# EasyEDA schematic 炫彩灯带_2021-06-24.json
TITLE: 幻彩灯带SOC免开发版; REV: 0.0; Date: 2021-05-28; Sheet: 1/2; Drawn By: QQ1445886007; Company: Your Company
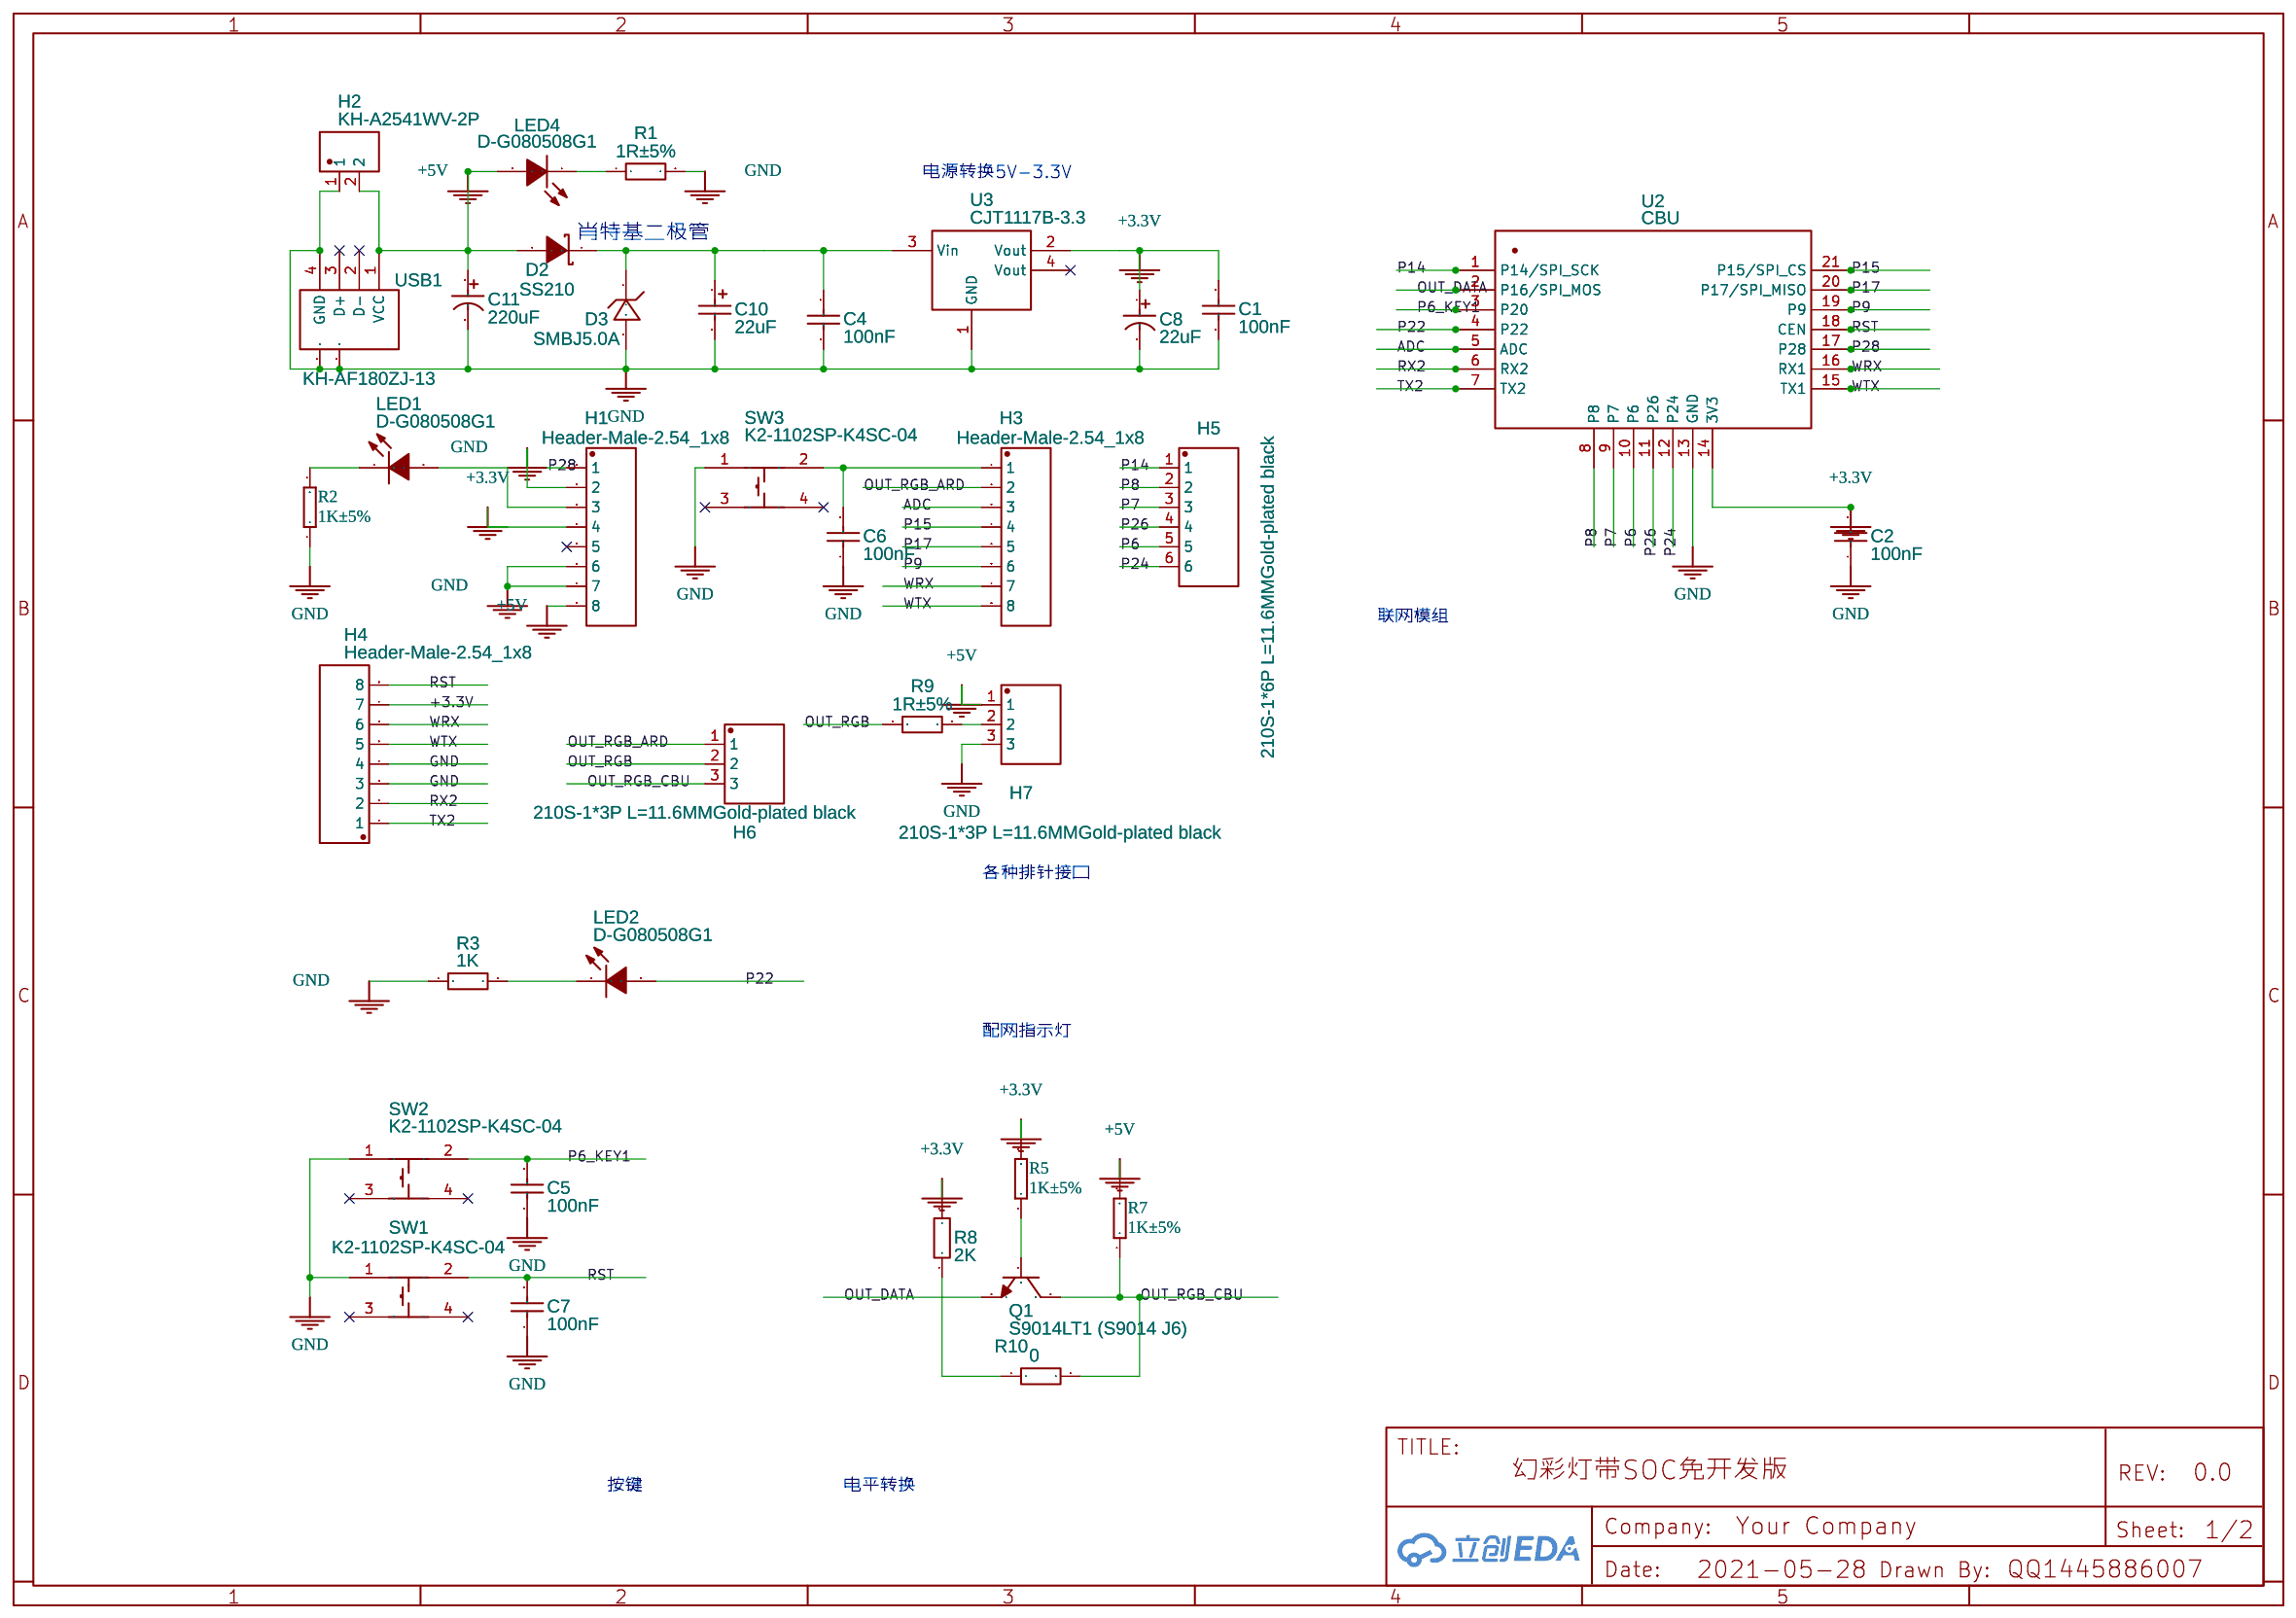
[diagram p0: schematic sheet]

## Parts
C1  100nF  [C0603]
C2  100nF  [C0603]
C4  100nF  [C0603]
C5  100nF  [C0603]
C6  100nF  [C0603]
C7  100nF  [C0603]
C8  22uF  [CAP-TH_BD4.0-P1.50-D0.8-FD]
C10  22uF  [CAP-SMD_L3.5-W2.8]
C11  220uF  [CAP-TH_BD6.3-P2.50-D1.0-FD]
D2  SS210  [SMA_L4.4-W2.6-LS5.0-RD]
D3  SMBJ5.0A  [SMB_L4.6-W3.6-LS5.3-RD]
H1  Header-Male-2.54_1x8  [HDR-TH_8P-P2.54-V-M]
H2  KH-A2541WV-2P  [HDR-TH_2P-P2.54-V-M]
H3  Header-Male-2.54_1x8  [HDR-TH_8P-P2.54-V-M]
H4  Header-Male-2.54_1x8  [HDR-TH_8P-P2.54-V-M]
H5  210S-1*6P L=11.6MMGold-plated black  [HDR-TH_6P-P2.54-V_Z-211-0611-0021-001]
H6  210S-1*3P L=11.6MMGold-plated black  [HDR-TH_3P-P2.54-V]
H7  210S-1*3P L=11.6MMGold-plated black  [HDR-TH_3P-P2.54-V]
LED1  D-G080508G1  [LED0805-RD]
LED2  D-G080508G1  [LED0805-RD]
LED4  D-G080508G1  [LED0805-RD]
Q1  S9014LT1 (S9014 J6)  [SOT-23-3_L2.9-W1.3-P1.90-LS2.4-BR]
R1  1R±5%  [R0603]
R2  1K±5%  [R0603]
R3  1K  [R0603]
R5  1K±5%  [R0603]
R7  1K±5%  [R0603]
R8  2K  [R0603]
R9  1R±5%  [R0603]
R10  0  [R0603]
SW1  K2-1102SP-K4SC-04  [KEY-SMD_4P-L6.0-W6.0-P4.50-LS10.0]
SW2  K2-1102SP-K4SC-04  [KEY-SMD_4P-L6.0-W6.0-P4.50-LS10.0]
SW3  K2-1102SP-K4SC-04  [KEY-SMD_4P-L6.0-W6.0-P4.50-LS10.0]
U2  CBU  [CBU]
U3  CJT1117B-3.3  [SOT-223-4_L6.5-W3.5-P2.30-LS7.0-BR]
USB1  KH-AF180ZJ-13  [USB-A-TH_KH-AF180ZJ-13]

## Library data of the parts
C1 C2 C4-C7 = CL10F104ZA8NNNC: Supplier: LCSC; Manufacturer: SAMSUNG; Supplier Part: C95838; JLCPCB Part Class: Extended Part
C8 = KS1C220MB070A00CV0: Supplier: LCSC; Supplier Part: C216316; Manufacturer: Changzhou Huawei Elec; Contributor: LCSC; JLCPCB Part Class: Extended Part
C10 = CA45-B010K226T: Supplier: LCSC; Manufacturer: Xiangyee; Supplier Part: C122758; JLCPCB Part Class: Extended Part
C11 = 220uF 10V 6.3*7: Supplier: LCSC; Manufacturer: ValuePro; Supplier Part: C43331; JLCPCB Part Class: Extended Part
D2 = SS210_C84030: Supplier: LCSC; Manufacturer: STARSEA; Supplier Part: C84030; JLCPCB Part Class: Extended Part
D3 = SMBJ5.0A_C169448: Supplier: LCSC; Supplier Part: C169448; Manufacturer: Shandong Jingdao Microelectronics; Contributor: LCSC; JLCPCB Part Class: Extended Part
H1 H3 H4 = Header-Male-2.54_1x8: Supplier: LCSC; Manufacturer: Ckmtw; Manufacturer Part: 210S-1*8P L=11.6MMGold-plated black; Contributor: LCSC; Supplier Part: C124381; JLCPCB Part Class: Extended Part; Package Display: No
H2 = KH-A2541WV-2P: Supplier: LCSC; Supplier Part: C2833329; Manufacturer: kinghelm(金航标); Contributor: LCSC
H5 = 210S-1*6P L=11.6MMGold-plated black: Supplier: LCSC; Manufacturer: Ckmtw; Contributor: LCSC; Supplier Part: C124380; JLCPCB Part Class: Extended Part; Package Display: No
H6 H7 = 210S-1*3P L=11.6MMGold-plated black: Supplier: LCSC; Manufacturer: Ckmtw; Contributor: LCSC; Supplier Part: C124376; JLCPCB Part Class: Extended Part; Package Display: No
LED1 LED2 LED4 = D-G080508G1: Supplier: LCSC; Manufacturer: ARKLED; Contributor: LCSC; Supplier Part: C107402; JLCPCB Part Class: Extended Part
Q1 = S9014LT1 (S9014 J6): Supplier: LCSC; Manufacturer: CJ; Supplier Part: C2148; JLCPCB Part Class: Extended Part
R1 R9 = 0603WAJ010JT5E: Supplier: LCSC; Manufacturer: UniOhm; Supplier Part: C25212; JLCPCB Part Class: Extended Part
R3 = RK73B1JTTD102J: Supplier: LCSC; Manufacturer: KOA; Supplier Part: C131707; JLCPCB Part Class: Extended Part
R8 = RM06FTN2001: Supplier: LCSC; Manufacturer: TA-I; Contributor: LCSC; Supplier Part: C114806
R10 = RM06JTN0: Supplier: LCSC; Supplier Part: C188117; Manufacturer: TA-I Tech; Contributor: LCSC
SW1-SW3 = K2-1102SP-K4SC-04: Supplier: LCSC; Manufacturer: HRO; Contributor: LCSC; Supplier Part: C129461; JLCPCB Part Class: Extended Part
U2 = CBU: Supplier: 涂鸦智能; link: https://developer.tuya.com/cn/docs/iot/device-development/module/wifibt-dual-mode-module/cb-series-module/cbu-module-datasheet?id=Ka07pykl5dk4u#title-5-%E5%B0%BA%E5%AF%B8%E5%B0%81%E8%A3%85; Contributor: anhezhou
U3 = CJT1117B-3.3: Supplier: LCSC; Manufacturer: CJ; Supplier Part: C78777; JLCPCB Part Class: Extended Part
USB1 = KH-AF180ZJ-13: Supplier: LCSC; Supplier Part: C2833344; Manufacturer: kinghelm(金航标); Contributor: LCSC; Package Display: No

## Nets
+3.3V: C1.2 C2.2 C8.1 H1.4 H4.7 R5.2 R8.1 U2.14(3V3) U3.2(Vout)
+5V: C11.1 D2.2(A) H1.8 H2.2 H7.1 LED4.2(A) R7.2 USB1.1(VCC)
GND: C1.1 C2.1 C4.1 C5.1 C6.1 C7.1 C8.2 C10.2 C11.2 D3.2 H1.2 H1.6 H1.7 H2.1 H4.3 H4.4 H7.3 R1.2 R2.1 R3.1 SW1.1 SW2.1 SW3.1 U2.13(GND) U3.1(GND) USB1.4(GND) USB1.5 USB1.6
ADC: H3.3 U2.5(ADC)
OUT_DATA: Q1.2(E) R8.2 R10.1 U2.2(P16/SPI_MOS)
OUT_RGB: H6.2 R9.1
OUT_RGB_ARD: H3.2 H6.1
OUT_RGB_CBU: H6.3 Q1.3(C) R7.1 R10.2
P6: H5.5 U2.10(P6)
P6_KEY1: C5.2 SW2.2 U2.3(P20)
P7: H5.3 U2.9(P7)
P8: H5.2 U2.8(P8)
P9: H3.6 U2.19(P9)
P14: H5.1 U2.1(P14/SPI_SCK)
P15: H3.4 U2.21(P15/SPI_CS)
P17: H3.5 U2.20(P17/SPI_MISO)
P22: LED2.2(A) U2.4(P22)
P24: H5.6 U2.12(P24)
P26: H5.4 U2.11(P26)
P28: H1.1 U2.17(P28)
RST: C7.2 H4.8 SW1.2 U2.18(CEN)
RX2: H4.2 U2.6(RX2)
TX2: H4.1 U2.7(TX2)
WRX: H3.7 H4.6 U2.16(RX1)
WTX: H3.8 H4.5 U2.15(TX1)
Net-(C4-2): C4.2 C10.1 D2.1(C) D3.1 U3.3(Vin)
Net-(C6-2): C6.2 H3.1 SW3.2
Net-(H1-3): H1.3 LED1.2(A)
Net-(H7-2): H7.2 R9.2
Net-(LED1-1): LED1.1(K) R2.2
Net-(LED2-1): LED2.1(K) R3.2
Net-(LED4-1): LED4.1(K) R1.1
Net-(Q1-1): Q1.1(B) R5.1

Not connected (* = marked no-connect by the designer): H1 5*; SW1 3* 4*; SW2 3* 4*; SW3 3* 4*; U3 4(Vout)*; USB1 2(D-)* 3(D+)*

## Notes on the sheet
- 电源转换5V-3.3V
- 肖特基二极管
- 联网模组
- 各种排针接口
- 配网指示灯
- 按键
- 电平转换
